# Altium schematic sheet Process.SchDoc
size 297 x 209 mm; SheetNumber: 3; SheetTotal: 4
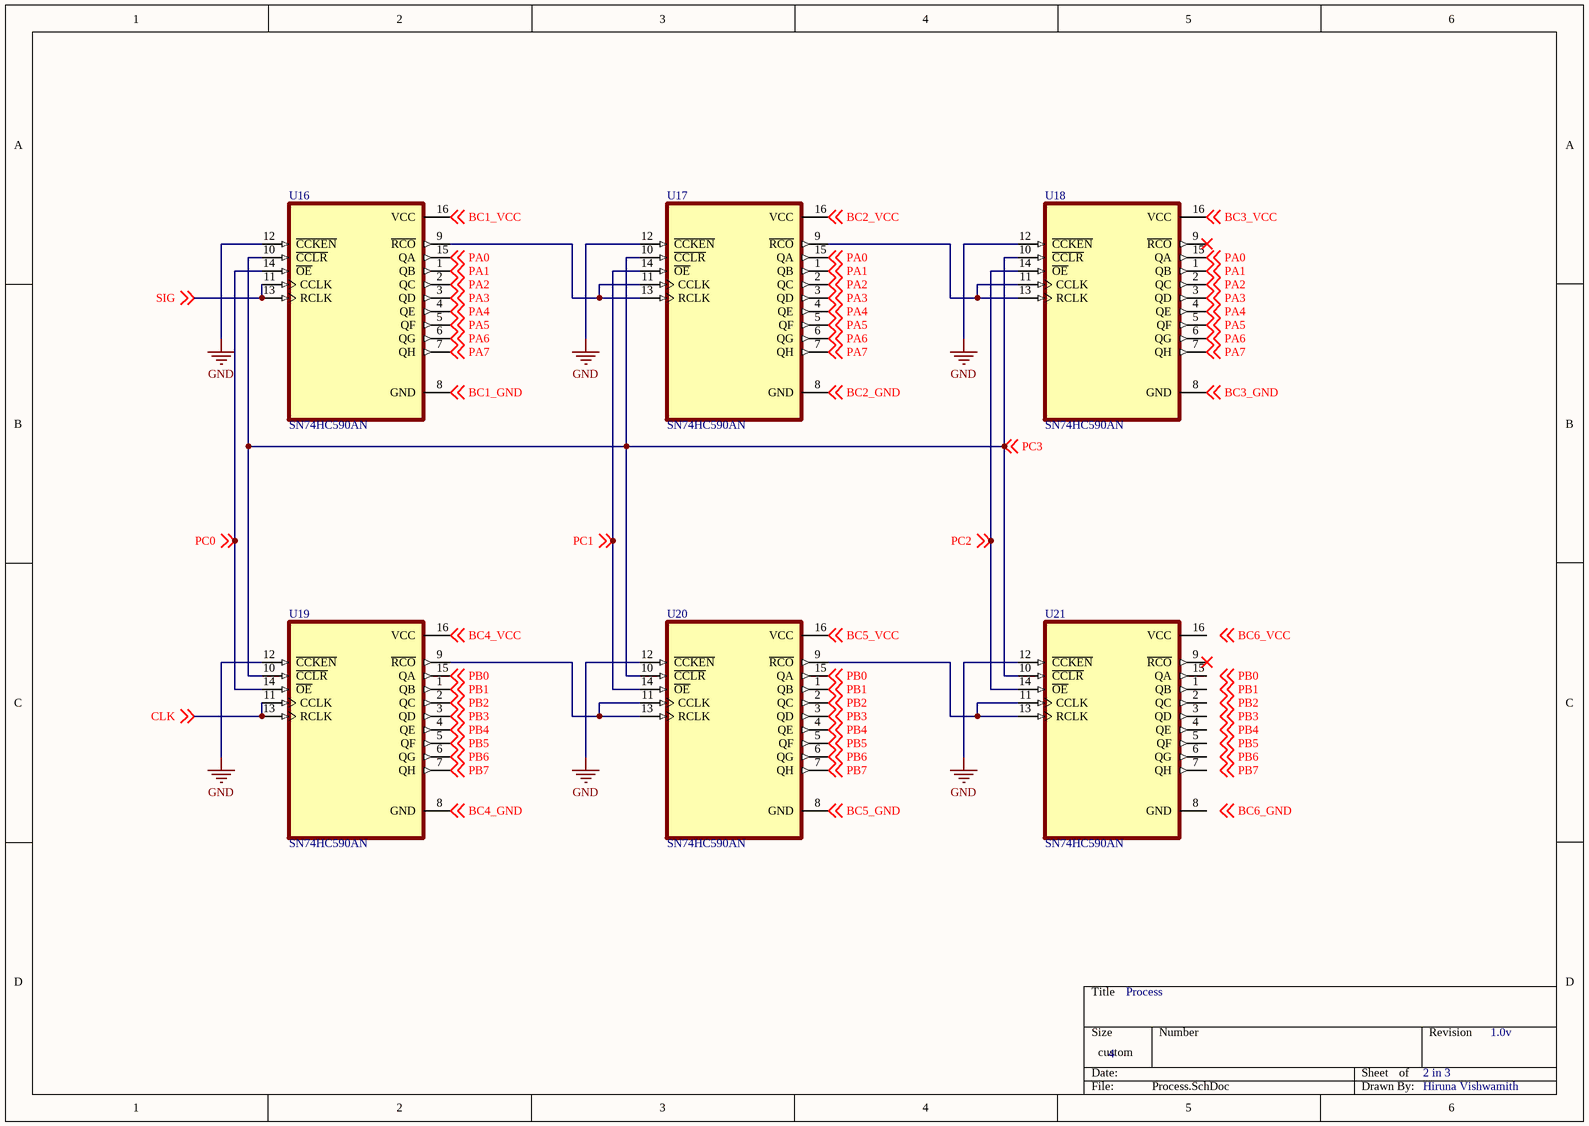
[diagram p0: Process.SchDoc]

## Parts
U16  SN74HC590AN  [DIP794W45P254L1969H508Q16]
U17  SN74HC590AN  [DIP794W45P254L1969H508Q16]
U18  SN74HC590AN  [DIP794W45P254L1969H508Q16]
U19  SN74HC590AN  [DIP794W45P254L1969H508Q16]
U20  SN74HC590AN  [DIP794W45P254L1969H508Q16]
U21  SN74HC590AN  [DIP794W45P254L1969H508Q16]

## Nets
GND: U16.12(~{CCKEN}) U17.12(~{CCKEN}) U18.12(~{CCKEN}) U19.12(~{CCKEN}) U20.12(~{CCKEN}) U21.12(~{CCKEN})
BC1_GND: U16.8(GND) ; off-sheet BC1_GND
BC1_VCC: U16.16(VCC) ; off-sheet BC1_VCC
BC2_GND: U17.8(GND) ; off-sheet BC2_GND
BC2_VCC: U17.16(VCC) ; off-sheet BC2_VCC
BC3_GND: U18.8(GND) ; off-sheet BC3_GND
BC3_VCC: U18.16(VCC) ; off-sheet BC3_VCC
BC4_GND: U19.8(GND) ; off-sheet BC4_GND
BC4_VCC: U19.16(VCC) ; off-sheet BC4_VCC
BC5_GND: U20.8(GND) ; off-sheet BC5_GND
BC5_VCC: U20.16(VCC) ; off-sheet BC5_VCC
CLK: U19.11(CCLK) U19.13(RCLK) ; off-sheet CLK
PA0: U16.15(QA) U17.15(QA) U18.15(QA) ; off-sheet PA0
PA1: U16.1(QB) U17.1(QB) U18.1(QB) ; off-sheet PA1
PA2: U16.2(QC) U17.2(QC) U18.2(QC) ; off-sheet PA2
PA3: U16.3(QD) U17.3(QD) U18.3(QD) ; off-sheet PA3
PA4: U16.4(QE) U17.4(QE) U18.4(QE) ; off-sheet PA4
PA5: U16.5(QF) U17.5(QF) U18.5(QF) ; off-sheet PA5
PA6: U16.6(QG) U17.6(QG) U18.6(QG) ; off-sheet PA6
PA7: U16.7(QH) U17.7(QH) U18.7(QH) ; off-sheet PA7
PB0: U19.15(QA) U20.15(QA) ; off-sheet PB0
PB1: U19.1(QB) U20.1(QB) ; off-sheet PB1
PB2: U19.2(QC) U20.2(QC) ; off-sheet PB2
PB3: U19.3(QD) U20.3(QD) ; off-sheet PB3
PB4: U19.4(QE) U20.4(QE) ; off-sheet PB4
PB5: U19.5(QF) U20.5(QF) ; off-sheet PB5
PB6: U19.6(QG) U20.6(QG) ; off-sheet PB6
PB7: U19.7(QH) U20.7(QH) ; off-sheet PB7
PC0: U16.14(~{OE}) U19.14(~{OE}) ; off-sheet PC0
PC1: U17.14(~{OE}) U20.14(~{OE}) ; off-sheet PC1
PC2: U18.14(~{OE}) U21.14(~{OE}) ; off-sheet PC2
PC3: U16.10(~{CCLR}) U17.10(~{CCLR}) U18.10(~{CCLR}) U19.10(~{CCLR}) U20.10(~{CCLR}) U21.10(~{CCLR}) ; off-sheet PC3
SIG: U16.11(CCLK) U16.13(RCLK) ; off-sheet SIG
NetU16_9: U16.9(~{RCO}) U17.11(CCLK) U17.13(RCLK)
NetU17_9: U17.9(~{RCO}) U18.11(CCLK) U18.13(RCLK)
NetU19_9: U19.9(~{RCO}) U20.11(CCLK) U20.13(RCLK)
NetU20_9: U20.9(~{RCO}) U21.11(CCLK) U21.13(RCLK)

Not connected (* = marked no-connect by the designer): U18 9(~{RCO})*; U21 1(QB) 2(QC) 3(QD) 4(QE) 5(QF) 6(QG) 7(QH) 8(GND) 9(~{RCO})* 15(QA) 16(VCC)

## Notes on the sheet
- Process
- 4
- 2 in 3
- 1.0v
- Hiruna Vishwamith
- Labels drawn without touching a wire or pin: BC6_GND, BC6_VCC, PB0, PB1, PB2, PB3, PB4, PB5, PB6, PB7

## Library data of the parts
U16-U21 = SN74HC590AN: 8-Bit Binary Counters With 3-State Output Registers 16-PDIP -40 to 85; MF: Texas Instruments; Value: *; MP: SN74HC590AN; SnapEDA_Link: https://www.snapeda.com/parts/SN74HC590AN/Texas%20Instruments/view-part/385662/?ref=snap; Package: PDIP-16 Texas Instruments; Digi-Key_Part_Number: SN74HC590ANG4-ND; Texas_Instruments-Purchase-URL: https://snapeda.com/shop?store=Texas+Instruments&id=385662; BuyPart: https://www.snapeda.com/parts/SN74HC590AN/Texas%20Instruments/view-part/385662/?ref=eda